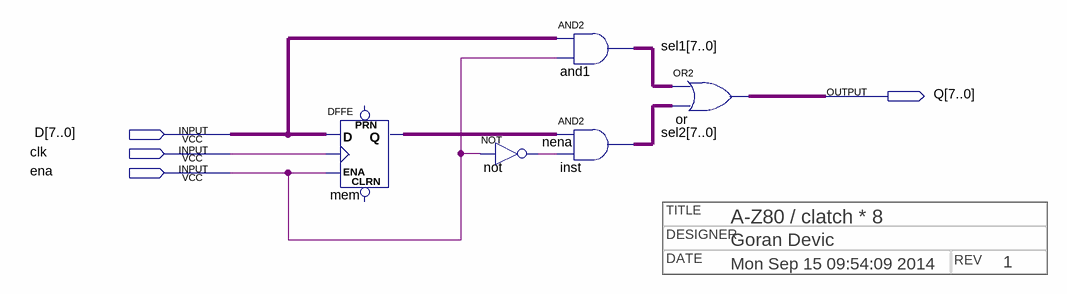
[diagram p0: schematic sheet]
// Quartus schematic clatch8.bdf as structural Verilog: 5 symbols, 4 pins
// Title block: DATE: Mon Sep 15 09:54:09 2014; DESIGNER: Goran Devic; REV: 1; TITLE: A-Z80 / clatch * 8
module clatch8 (
  input  [7:0] D,
  input  clk,
  input  ena,
  output [7:0] Q
);

  wire nena;
  wire [7:0] mem_q, sel1, sel2;

  DFFE mem[7:0] (.D(D), .CLK(clk), .ENA(ena), .Q(mem_q));  // open: PRN, CLRN
  not \not  (nena, ena);
  assign sel1 = D & {8{ena}};  // AND2 and1, 8 bits wide
  assign sel2 = mem_q & {8{nena}};  // AND2 inst, 8 bits wide
  assign Q = sel1 | sel2;  // OR2 or, 8 bits wide
endmodule
